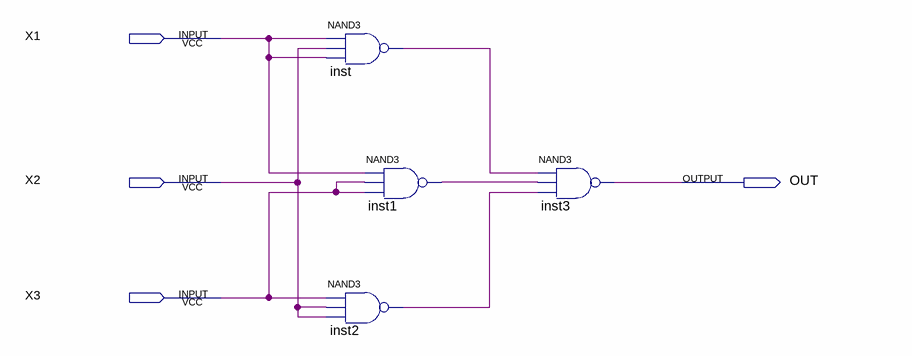
[diagram p0: schematic sheet]
// Quartus schematic Lab_4_part_2.bdf as structural Verilog: 4 symbols, 4 pins
module Lab_4_part_2 (
  input  X1,
  input  X2,
  input  X3,
  output OUT
);

  wire inst1_out, inst2_out, inst_out;

  nand inst (inst_out, X1, X2, X1);
  nand inst2 (inst2_out, X3, X2, X2);
  nand inst1 (inst1_out, X1, X3, X3);
  nand inst3 (OUT, inst_out, inst1_out, inst2_out);
endmodule
